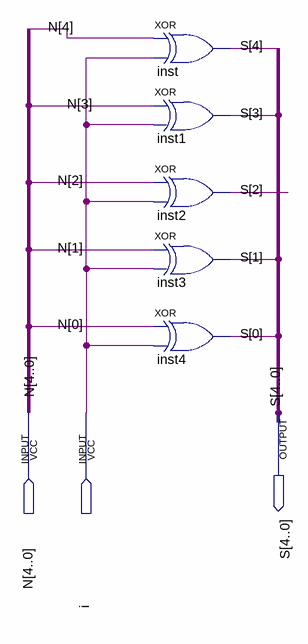
[diagram p0: schematic sheet]
// Quartus schematic complement.bdf as structural Verilog: 5 symbols, 3 pins
module complement (
  input  [4:0] N,
  input  i,
  output [4:0] S
);

  xor inst (S[4], N[4], i);
  xor inst1 (S[3], N[3], i);
  xor inst2 (S[2], N[2], i);
  xor inst3 (S[1], N[1], i);
  xor inst4 (S[0], N[0], i);
endmodule
